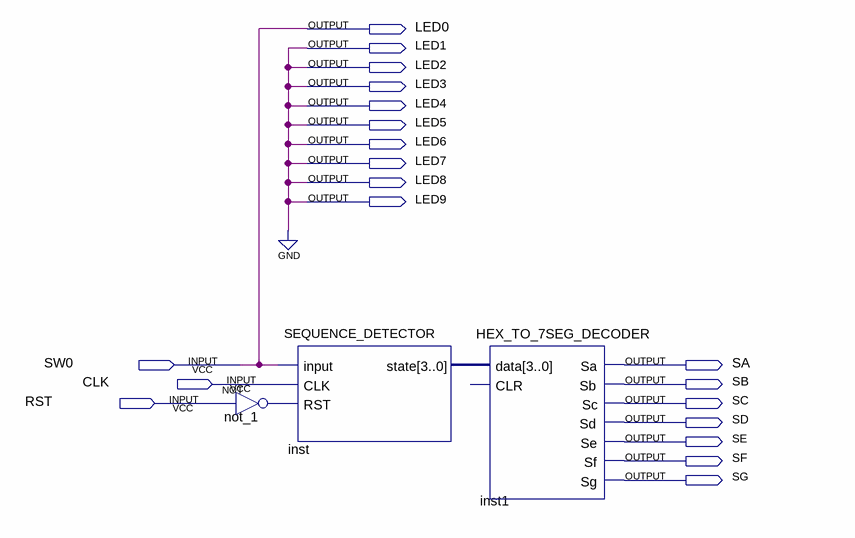
[diagram p0: schematic sheet]
// Quartus schematic main.bdf as structural Verilog: 3 symbols, 20 pins
module main (
  input  SW0,
  input  CLK,
  input  RST,
  output LED0,
  output LED1,
  output LED2,
  output LED3,
  output LED4,
  output LED5,
  output LED6,
  output LED7,
  output LED8,
  output LED9,
  output SA,
  output SB,
  output SC,
  output SD,
  output SE,
  output SF,
  output SG
);

  wire not_1_out;
  wire [3:0] inst_state;

  not not_1 (not_1_out, RST);
  SEQUENCE_DETECTOR inst (.\input (SW0), .CLK(CLK), .RST(not_1_out), .state(inst_state));
  HEX_TO_7SEG_DECODER inst1 (
    .data(inst_state), .Sa(SA), .Sb(SB), .Sc(SC), .Sd(SD), .Se(SE), .Sf(SF), .Sg(SG));  // open: CLR

  assign LED0 = SW0;
  assign LED1 = 1'b0;
  assign LED2 = 1'b0;
  assign LED3 = 1'b0;
  assign LED4 = 1'b0;
  assign LED5 = 1'b0;
  assign LED6 = 1'b0;
  assign LED7 = 1'b0;
  assign LED8 = 1'b0;
  assign LED9 = 1'b0;
endmodule
